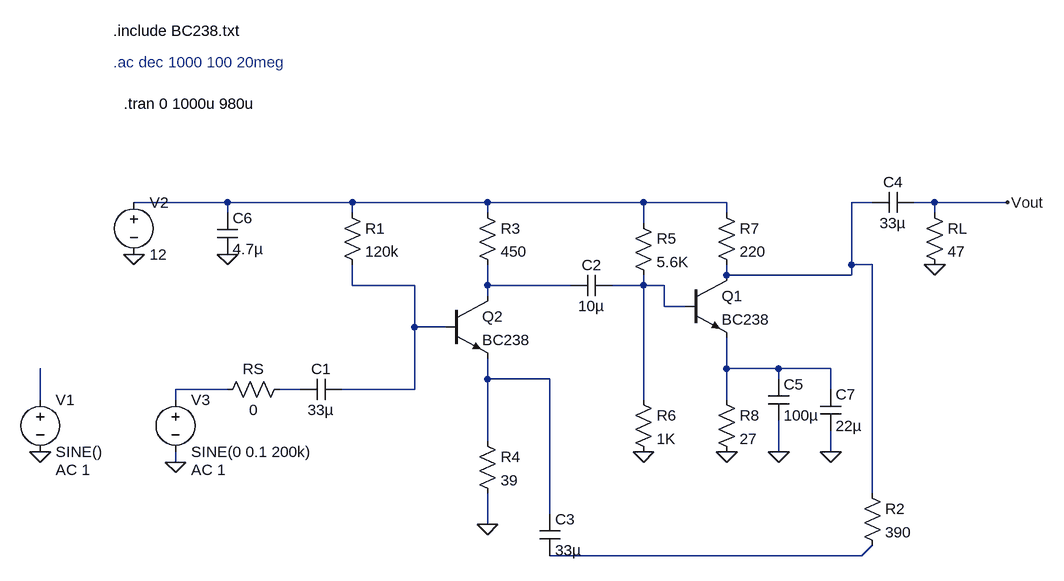
[diagram p0: schematic Lab4444 (1).asc]
Lab4444 (1).asc, the LTspice schematic file:
Version 4
SHEET 1 1704 680
WIRE 160 -208 16 -208
WIRE 352 -208 160 -208
WIRE 560 -208 352 -208
WIRE 800 -208 560 -208
WIRE 928 -208 800 -208
WIRE 1152 -208 1120 -208
WIRE 1248 -208 1216 -208
WIRE 1360 -208 1248 -208
WIRE 160 -192 160 -208
WIRE 352 -192 352 -208
WIRE 560 -192 560 -208
WIRE 928 -192 928 -208
WIRE 1248 -192 1248 -208
WIRE 800 -176 800 -208
WIRE 1120 -112 1120 -208
WIRE 1152 -112 1120 -112
WIRE 928 -96 928 -112
WIRE 1120 -96 1120 -112
WIRE 1120 -96 928 -96
WIRE 352 -80 352 -112
WIRE 448 -80 352 -80
WIRE 560 -80 560 -112
WIRE 688 -80 560 -80
WIRE 800 -80 800 -96
WIRE 800 -80 752 -80
WIRE 832 -80 800 -80
WIRE 560 -64 560 -80
WIRE 832 -48 832 -80
WIRE 864 -48 832 -48
WIRE 448 -16 448 -80
WIRE 496 -16 448 -16
WIRE 928 48 928 0
WIRE 1008 48 928 48
WIRE 1088 48 1008 48
WIRE 560 64 560 32
WIRE 656 64 560 64
WIRE 1008 64 1008 48
WIRE 160 80 80 80
WIRE 272 80 240 80
WIRE 448 80 448 -16
WIRE 448 80 336 80
WIRE 1088 80 1088 48
WIRE -128 96 -128 48
WIRE 80 96 80 80
WIRE 800 96 800 -80
WIRE 928 96 928 48
WIRE 560 160 560 64
WIRE 1008 176 1008 128
WIRE 1088 176 1088 144
WIRE 80 192 80 176
WIRE 1152 240 1152 -112
WIRE 656 272 656 64
WIRE 560 288 560 240
WIRE 1136 336 1152 320
WIRE 1136 336 656 336
FLAG 160 -128 0
FLAG 560 288 0
FLAG 928 176 0
FLAG 1008 176 0
FLAG 1248 -112 0
FLAG 16 -128 0
FLAG 800 176 0
FLAG -128 176 0
FLAG 80 192 0
FLAG 1360 -208 Vout
FLAG 1088 176 0
SYMBOL res 256 64 R90
WINDOW 0 0 56 VBottom 2
WINDOW 3 32 56 VTop 2
SYMATTR InstName RS
SYMATTR Value 0
SYMBOL cap 336 64 R90
WINDOW 0 0 32 VBottom 2
WINDOW 3 32 32 VTop 2
SYMATTR InstName C1
SYMATTR Value 33µ
SYMBOL res 336 -208 R0
SYMATTR InstName R1
SYMATTR Value 120k
SYMBOL cap 144 -192 R0
SYMATTR InstName C6
SYMATTR Value 4.7µ
SYMBOL res 544 -208 R0
SYMATTR InstName R3
SYMATTR Value 450
SYMBOL res 544 144 R0
SYMATTR InstName R4
SYMATTR Value 39
SYMBOL cap 752 -96 R90
WINDOW 0 0 32 VBottom 2
WINDOW 3 32 32 VTop 2
SYMATTR InstName C2
SYMATTR Value 10µ
SYMBOL res 784 -192 R0
SYMATTR InstName R5
SYMATTR Value 5.6K
SYMBOL npn 864 -96 R0
SYMATTR InstName Q1
SYMATTR Value BC238
SYMBOL res 912 80 R0
SYMATTR InstName R8
SYMATTR Value 27
SYMBOL cap 992 64 R0
SYMATTR InstName C5
SYMATTR Value 100µ
SYMBOL res 912 -208 R0
SYMATTR InstName R7
SYMATTR Value 220
SYMBOL cap 1216 -224 R90
WINDOW 0 0 32 VBottom 2
WINDOW 3 32 32 VTop 2
SYMATTR InstName C4
SYMATTR Value 33µ
SYMBOL res 1232 -208 R0
SYMATTR InstName RL
SYMATTR Value 47
SYMBOL voltage 16 -224 R0
WINDOW 123 0 0 Left 0
WINDOW 39 0 0 Left 0
SYMATTR InstName V2
SYMATTR Value 12
SYMBOL npn 496 -64 R0
SYMATTR InstName Q2
SYMATTR Value BC238
SYMBOL res 784 80 R0
SYMATTR InstName R6
SYMATTR Value 1K
SYMBOL voltage -128 80 R0
WINDOW 123 24 124 Left 2
WINDOW 39 0 0 Left 0
SYMATTR Value2 AC 1
SYMATTR InstName V1
SYMATTR Value SINE()
SYMBOL voltage 80 80 R0
WINDOW 123 24 124 Left 2
WINDOW 39 0 0 Left 0
SYMATTR Value2 AC 1
SYMATTR InstName V3
SYMATTR Value SINE(0 0.1 200k)
SYMBOL cap 1072 80 R0
SYMATTR InstName C7
SYMATTR Value 22µ
SYMBOL cap 640 272 R0
SYMATTR InstName C3
SYMATTR Value 33µ
SYMBOL res 1136 224 R0
SYMATTR InstName R2
SYMATTR Value 390
TEXT -16 -472 Left 2 !.include BC238.txt
TEXT -16 -424 Left 2 ;.ac dec 1000 100 20meg
TEXT 0 -360 Left 2 !.tran 0 1000u 980u

The netlist it stands for:
* Lab4444 (1).asc
RS N009 N008 0
C1 N003 N009 33µ
R1 N001 N003 120k
C6 N001 0 4.7µ
R3 N001 N004 450
R4 N007 0 39
C2 N005 N004 10µ
R5 N001 N005 5.6K
Q1 N002 N005 N006 0 BC238
R8 N006 0 27
C5 N006 0 100µ
R7 N001 N002 220
C4 Vout N002 33µ
RL Vout 0 47
V2 N001 0 12
Q2 N004 N003 N007 0 BC238
R6 N005 0 1K
V1 N010 0 SINE() AC 1
V3 N008 0 SINE(0 0.1 200k) AC 1
C7 N006 0 22µ
C3 N007 N011 33µ
R2 N002 N011 390
.model NPN NPN
.model PNP PNP
.lib standard.bjt
.include BC238.txt
* .ac dec 1000 100 20meg
.tran 0 1000u 980u
.backanno
.end